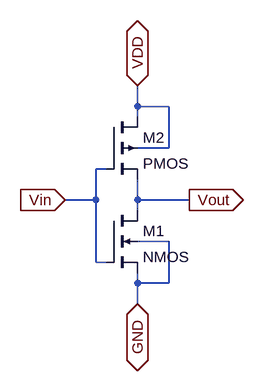
[diagram p0: schematic LT_0807ax.asc]
LT_0807ax.asc, the LTspice schematic file:
Version 4
SHEET 1 880 680
WIRE 96 80 96 48
WIRE 144 80 96 80
WIRE 96 96 96 80
WIRE 144 144 144 80
WIRE 144 144 96 144
WIRE 48 176 32 176
WIRE 32 224 32 176
WIRE 32 224 -16 224
WIRE 96 224 96 192
WIRE 176 224 96 224
WIRE 96 240 96 224
WIRE 144 288 96 288
WIRE 32 320 32 224
WIRE 48 320 32 320
WIRE 96 352 96 336
WIRE 144 352 144 288
WIRE 144 352 96 352
WIRE 96 384 96 352
FLAG 96 48 VDD
IOPIN 96 48 BiDir
FLAG 96 384 GND
IOPIN 96 384 BiDir
FLAG 176 224 Vout
IOPIN 176 224 Out
FLAG -16 224 Vin
IOPIN -16 224 In
SYMBOL nmos4 48 240 R0
SYMATTR InstName M1
SYMBOL pmos4 48 96 R0
SYMATTR InstName M2
SYMATTR Prefix MN

The netlist it stands for:
* LT_0807ax.asc
M1 Vout Vin GND GND NMOS
M2 VDD Vin Vout VDD PMOS
.model NMOS NMOS
.model PMOS PMOS
.lib standard.mos
.backanno
.end